# EasyEDA schematic SCH_ESP-RotaryCell-Main-Carrier-Rev-A1.2e_GND_3V3_Fix.json
TITLE: Sheet_1; REV: 1.0; Date: 2026-08-07; Sheet: 1/1; Drawn By: evilroot; Company: Your Company
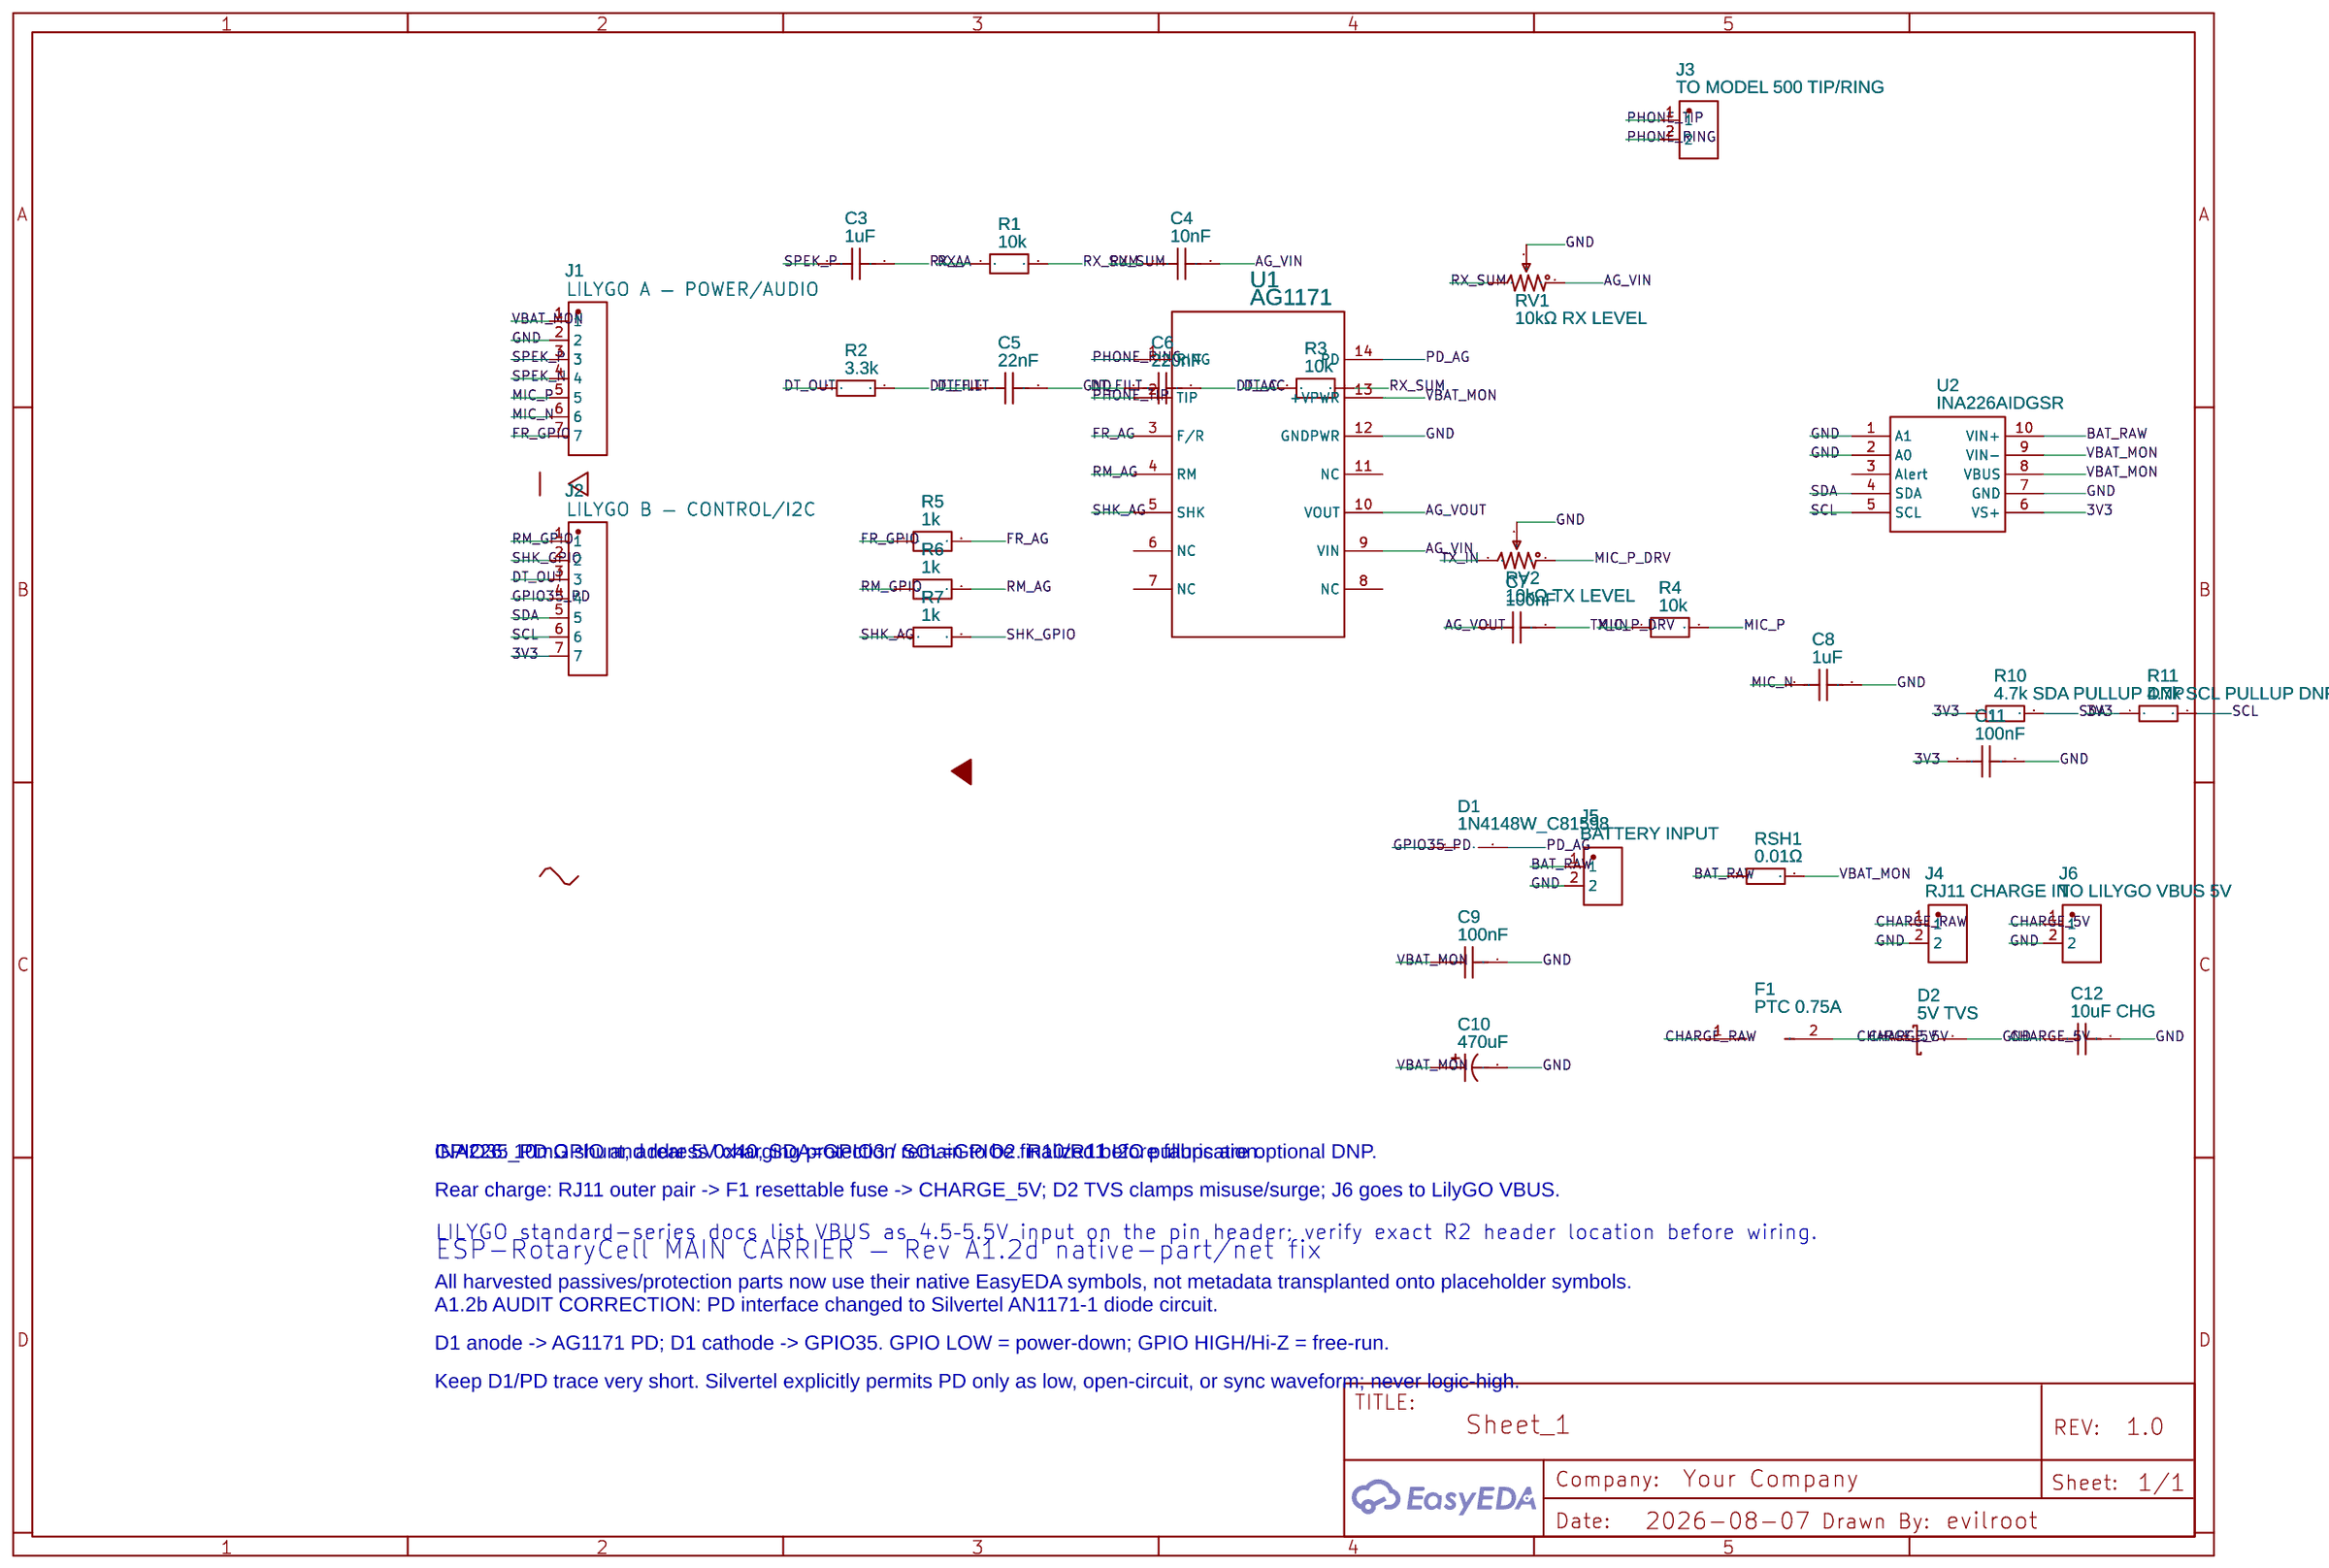
[diagram p0: schematic sheet]

## Parts
C3  1uF  [C0805]
C4  10nF  [C0805]
C5  22nF  [C0805]
C6  220nF  [C0805]
C7  100nF  [C0805]
C8  1uF  [C0805]
C9  100nF  [C0805]
C10  470uF  [CAP-TH_BD5.5-P2.50-D0.5-FD_RYHT16V470UF5.5X11]
C11  100nF  [C0805]
C12  10uF CHG  [C0805]
D1  1N4148W_C81598  [SOD-123F_L2.7-W1.6-LS3.8-RD]
D2  5V TVS  [SMA_L4.4-W2.6-LS5.0-RD]
F1  PTC 0.75A  [F1206]
J1  LILYGO A — POWER/AUDIO  [HDR-TH_7P-P2.54-V-F_PM2.54-1X7PZZ-H8.5]
J2  LILYGO B — CONTROL/I2C  [HDR-TH_7P-P2.54-V-F_PM2.54-1X7PZZ-H8.5]
J3  TO MODEL 500 TIP/RING  [HDR-TH_HMT-2.54-1X2PM]
J4  RJ11 CHARGE IN  [HDR-TH_HMT-2.54-1X2PM]
J5  BATTERY INPUT  [HDR-TH_HMT-2.54-1X2PM]
J6  TO LILYGO VBUS 5V  [HDR-TH_HMT-2.54-1X2PM]
R1  10k  [R0805]
R2  3.3k  [R0805]
R3  10k  [R0805]
R4  10k  [R0805]
R5  1k  [R0805]
R6  1k  [R0805]
R7  1k  [R0805]
R10  4.7k SDA PULLUP DNP  [R0805]
R11  4.7k SCL PULLUP DNP  [R0805]
RSH1  0.01Ω  [R2512]
RV1  10kΩ RX LEVEL  [RES-ADJ-SMD_PS10KV50-104A3030-PM]
RV2  10kΩ TX LEVEL  [RES-ADJ-SMD_PS10KV50-104A3030-PM]
U1  AG1171  [AG1171_SILVERTEL_THT_14P]
U2  INA226AIDGSR  [MSOP-10_L3.0-W3.0-P0.50-LS5.0-BL]

## Library data of the parts
C3 C8 = C0805C105K5RACAUTO: Supplier: LCSC; Supplier Part: C3874210; Manufacturer: KEMET(基美); JLCPCB Part Class: Extended Part; Contributor: lcsc
C4 = CGA0805X7R103J500KT: Supplier: LCSC; Supplier Part: C47117446; Manufacturer: HRE(芯声); JLCPCB Part Class: Extended Part; Contributor: lcsc
C5 = CGA0805C0G223J500MT: Supplier: LCSC; Supplier Part: C36911374; Manufacturer: HRE(芯声); JLCPCB Part Class: Extended Part; Contributor: lcsc
C6 = CGA0805X7R224K101MT: Supplier: LCSC; Supplier Part: C6119933; Manufacturer: HRE(芯声); Contributor: lcsc; JLCPCB Part Class: Extended Part
C7 C9 C11 = CAI0805X7R104K500KT: Supplier: LCSC; Supplier Part: C7496660; Manufacturer: HRE(芯声); Contributor: lcsc
C10 = RYHT16V470UF5.5*11: Supplier: LCSC; Supplier Part: C48970554; Manufacturer: HONOR(荣誉); JLCPCB Part Class: Extended Part; Contributor: lcsc
C12 = CGA0805X5R106K160MT: Supplier: LCSC; Supplier Part: C6119886; Manufacturer: HRE(芯声); Contributor: lcsc; JLCPCB Part Class: Extended Part
D1 = 1N4148W_C81598: Supplier: LCSC; Manufacturer: ST(先科); Manufacturer Part: 1N4148W; Supplier Part: C81598; JLCPCB Part Class: Basic Part
D2 = SMA6.0A_TVS6V: Contributor: lcsc; Supplier: LCSC; Supplier Part: C9900019684; Manufacturer: null; JLCPCB Part Class: Extended Part
F1 = PPTCNANOSMDC075F-20.75A6V: Contributor: lcsc; Supplier: LCSC; Supplier Part: C9900014746; Manufacturer: null; JLCPCB Part Class: Extended Part
J1 J2 = PM2.54-1X7PZZ-H8.5: Supplier: LCSC; Supplier Part: C54876729; Manufacturer: SHOU HAN(首韩); Manufacturer Part: PM2.54-1x7PZZ-H8.5; JLCPCB Part Class: Extended Part; Contributor: lcsc
J3-J6 = HMT-2.54-1*2PM: Supplier: LCSC; Supplier Part: C54620389; Manufacturer: HMTCONN(华明通); Contributor: lcsc; JLCPCB Part Class: Extended Part
R1 R3 R4 = RCS080510K0FKEA: Supplier: LCSC; Supplier Part: C4320396; Manufacturer: VISHAY(威世); JLCPCB Part Class: Extended Part; Contributor: lcsc
R2 = RMC08053.3K1%N: Contributor: LCSC; Supplier: LCSC; Supplier Part: C269541; Manufacturer: Tyohm(幸亚电阻); JLCPCB Part Class: Extended Part
R5-R7 = CL0805JN1KPS: Supplier: LCSC; Supplier Part: C50397181; Manufacturer: 昶龙科技; JLCPCB Part Class: Extended Part; Contributor: lcsc
R10 R11 = RMC08054.7K1%N: Contributor: LCSC; Supplier: LCSC; Supplier Part: C269746; Manufacturer: Tyohm(幸亚电阻); JLCPCB Part Class: Extended Part
RSH1 = MRF6432(2512)LR010JTS: Supplier Part: C76272; Supplier: LCSC; Manufacturer: SUP; JLCPCB Part Class: Extended Part
RV1 RV2 = PS10KV50-103A3030: Supplier: LCSC; Supplier Part: C7261862; Manufacturer: Amphenol; Contributor: lcsc; JLCPCB Part Class: Extended Part
U1 = AG1171: Manufacturer: Silver Telecom; Manufacturer Part: Ag1171; Contributor: evilroot
U2 = INA226AIDGSR: Supplier: LCSC; Manufacturer: TI(德州仪器); Supplier Part: C49851; JLCPCB Part Class: Extended Part

## Nets
3V3: C11.1 J2.7 R10.1 R11.1 U2.6(VS+)
GND: C5.2 C8.2 C9.2 C10.2 C11.2 C12.2 D2.2(A) J1.2 J4.2 J5.2 J6.2 RV1.3 RV2.3 U1.12(GNDPWR) U2.1(A1) U2.2(A0) U2.7(GND)
VBAT_MON: C9.1 C10.1 J1.1 RSH1.2 U1.13(+VPWR) U2.8(VBUS) U2.9(VIN-)
AG_VIN: C4.2 RV1.2 U1.9(VIN)
AG_VOUT: C7.1 U1.10(VOUT)
BAT_RAW: J5.1 RSH1.1 U2.10(VIN+)
CHARGE_5V: C12.1 D2.1(C) F1.2 J6.1
CHARGE_RAW: F1.1 J4.1
DT_AC: C6.2 R3.1
DT_FILT: C5.1 C6.1 R2.2
DT_OUT: J2.3 R2.1
FR_AG: R5.2 U1.3(F/R)
FR_GPIO: J1.7 R5.1
GPIO35_PD: D1.1(K) J2.4
MIC_N: C8.1 J1.6
MIC_P: J1.5 R4.2
MIC_P_DRV: R4.1 RV2.2
PD_AG: D1.2(A) U1.14(PD)
PHONE_RING: J3.2 U1.1(RING)
PHONE_TIP: J3.1 U1.2(TIP)
RM_AG: R6.2 U1.4(RM)
RM_GPIO: J2.1 R6.1
RX_A: C3.2 R1.1
RX_SUM: C4.1 R1.2 R3.2 RV1.1
SCL: J2.6 R11.2 U2.5(SCL)
SDA: J2.5 R10.2 U2.4(SDA)
SHK_AG: R7.1 U1.5(SHK)
SHK_GPIO: J2.2 R7.2
SPEK_N: J1.4
SPEK_P: C3.1 J1.3
TX_IN: C7.2 RV2.1

Not connected (* = marked no-connect by the designer): U1 6(NC) 7(NC) 8(NC) 11(NC); U2 3(Alert)

## Notes on the sheet
- GPIO35_PD GPIO and rear 5V charging protection remain to be finalized before fabrication.
- INA226: 10mΩ shunt, address 0x40, SDA=GPIO3 / SCL=GPIO2. R10/R11 I2C pullups are optional DNP.
- Rear charge: RJ11 outer pair -> F1 resettable fuse -> CHARGE_5V; D2 TVS clamps misuse/surge; J6 goes to LilyGO VBUS.
- ESP-RotaryCell MAIN CARRIER — Rev A1.2d native-part/net fix
- LILYGO standard-series docs list VBUS as 4.5–5.5V input on the pin header; verify exact R2 header location before wiring.
- All harvested passives/protection parts now use their native EasyEDA symbols, not metadata transplanted onto placeholder symbols.
- A1.2b AUDIT CORRECTION: PD interface changed to Silvertel AN1171-1 diode circuit.
- D1 anode -> AG1171 PD; D1 cathode -> GPIO35. GPIO LOW = power-down; GPIO HIGH/Hi-Z = free-run.
- Keep D1/PD trace very short. Silvertel explicitly permits PD only as low, open-circuit, or sync waveform; never logic-high.
